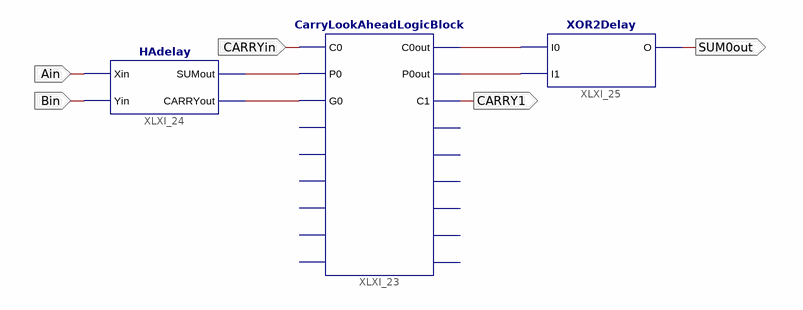
[diagram p0: schematic sheet 1]
// Xilinx ISE schematic OneBitClaLogicBlock.sch (spartan6) as structural Verilog: 3 symbols, 5 ports
module OneBitClaLogicBlock (
  input  CARRYin,
  input  Ain,
  input  Bin,
  output CARRY1,
  output SUM0out
);

  wire XLXN_45, XLXN_46, XLXN_47, XLXN_48;

  CarryLookAheadLogicBlock XLXI_23 (
    .C0(CARRYin), .P0(XLXN_45), .G0(XLXN_46), .C0out(XLXN_47), .P0out(XLXN_48), .C1(CARRY1));  // open: P1, G1, P2, G2, P3, G3, P1out, C2, P2out, C3, P3out, C4
  XOR2Delay XLXI_25 (.I0(XLXN_47), .I1(XLXN_48), .O(SUM0out));
  HAdelay XLXI_24 (.Xin(Ain), .Yin(Bin), .SUMout(XLXN_45), .CARRYout(XLXN_46));
endmodule
